# EAGLE design DAQ1 (EAGLE 7.5.0)

## Sheet 1 of 2
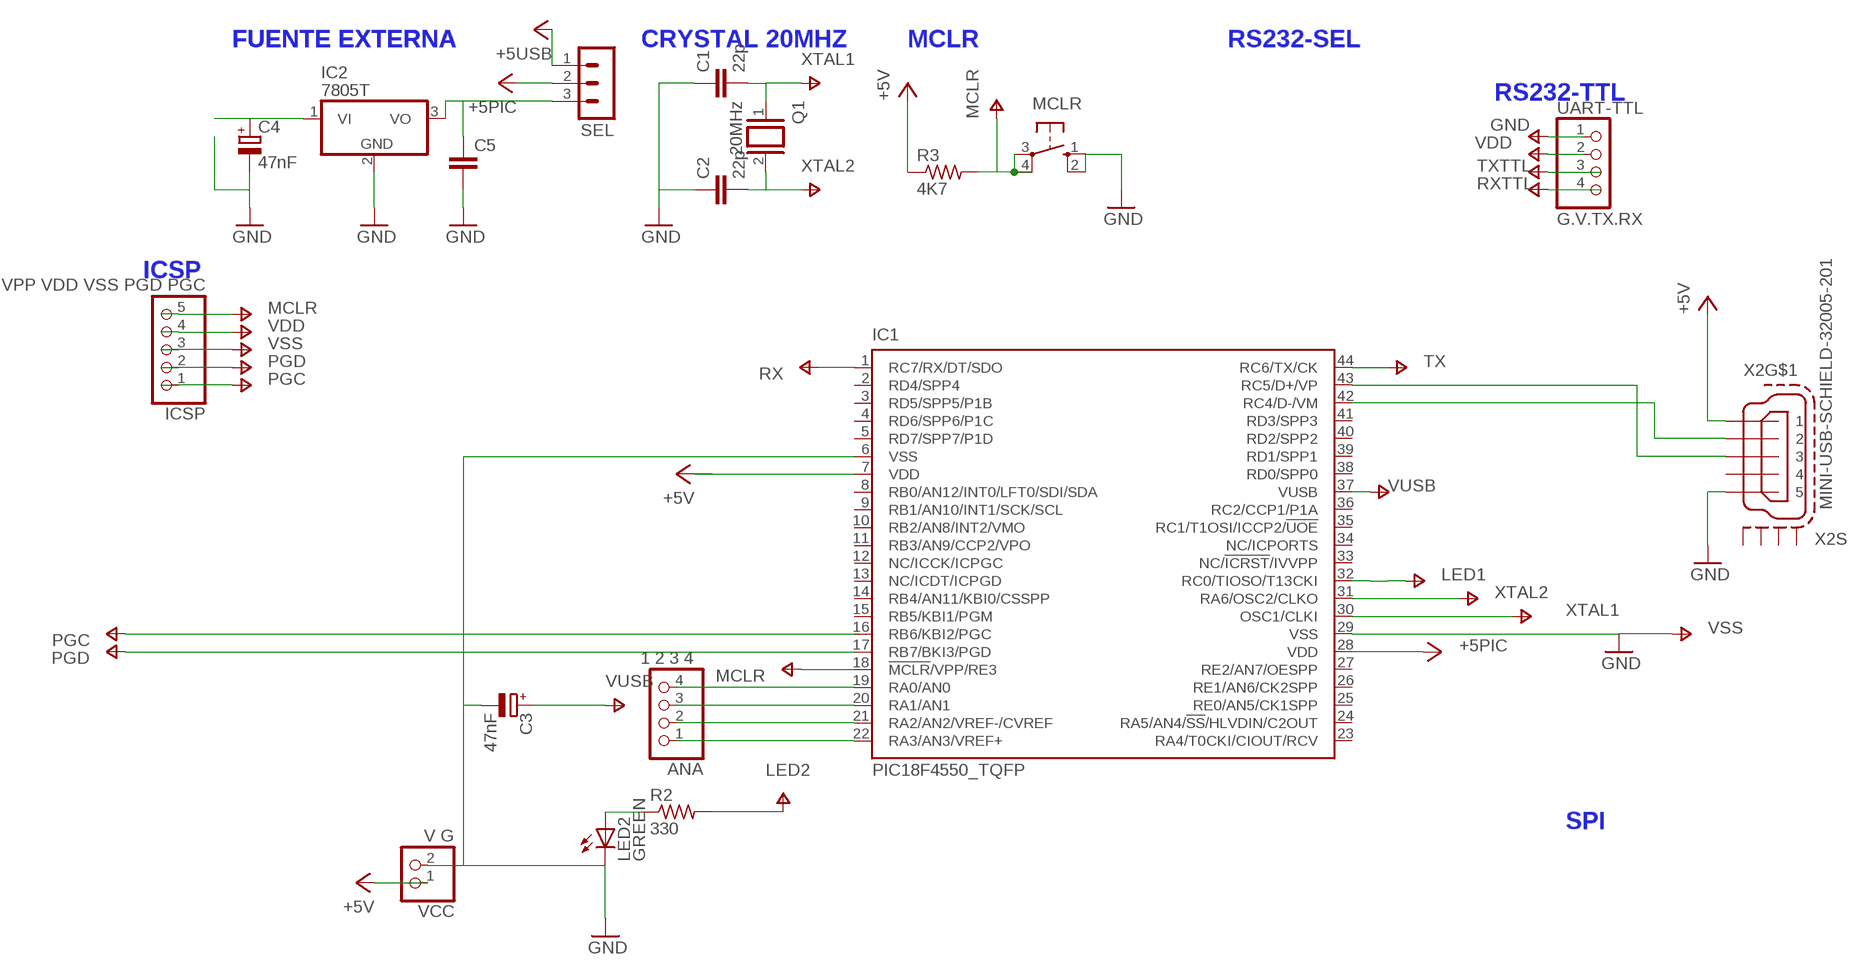
[diagram p0: schematic, sheet 1]

### Parts
ANA  1 2 3 4  PINHD-1X4  [1X04]
C1  22p  C-EU025-024X044  [C025-024X044]
C2  22p  C-EU025-024X044  [C025-024X044]
C3  47nF  CPOL-EUE2,5-6E  [E2,5-6E]
C4  47nF  CPOL-EUE2,5-6E  [E2,5-6E]
C5  C-EU050-035X075  [C050-035X075]
IC1  PIC18F4550_TQFP  [TQFP44]
IC2  7805T  [TO220H]
ICSP  VPP VDD VSS PGD PGC  PINHD-1X5  [1X05]
LED2  GREEN  TLLG4400  [LED3MM]
MCLR  10-XX  [B3F-10XX]
Q1  20MHz  XTAL/S  [QS]
R2  330  R-US_0207/10  [0207/10]
R3  4K7  R-US_0207/10  [0207/10]
SEL  MA03-1  [MA03-1]
UART-TTL  G.V.TX.RX  PINHD-1X4  [1X04]
VCC  V G  PINHD-1X2  [1X02]
X2  MINI-USB-SCHIELD-32005-201  [32005-201]

### Nets
+5PIC: IC1.7(VDD) IC1.28(VDD) ICSP.4 R3.1 SEL.2 UART-TTL.2 VCC.1 ; supply symbol labelled +5V, VDD
+5USB: SEL.1 X2.1 ; supply symbol labelled +5V
AN0: ANA.4 IC1.19(RA0/AN0) ; also sheet 2
GND: C1.1 C2.1 C3.- C4.- C5.2 IC1.6(VSS) IC1.29(VSS) IC2.2(GND) ICSP.3 LED2.K(C) MCLR.1(S) MCLR.2(S1) UART-TTL.1 VCC.2 X2.5 ; supply symbol labelled VSS ; also sheet 2
LED1: IC1.32(RC0/TIOSO/T13CKI) R2.2 ; supply symbol labelled LED2
MCLR: IC1.18(!MCLR!/VPP/RE3) ICSP.5 MCLR.3(P) MCLR.4(P1) R3.2
N$1: IC1.42(RC4/D-/VM) X2.2
N$5: LED2.A R2.1
N$15: IC1.43(RC5/D+/VP) X2.3
N$24: ANA.3 IC1.20(RA1/AN1)
N$25: ANA.2 IC1.21(RA2/AN2/VREF-/CVREF)
N$26: ANA.1 IC1.22(RA3/AN3/VREF+)
N$132: C5.1 IC2.3(VO) SEL.3
PGC: IC1.16(RB6/KBI2/PGC) ICSP.1
PGD: IC1.17(RB7/BKI3/PGD) ICSP.2
RX: IC1.1(RC7/RX/DT/SDO) UART-TTL.4 ; supply symbol labelled RXTTL
TX: IC1.44(RC6/TX/CK) UART-TTL.3 ; supply symbol labelled TXTTL
VDD: C4.+ IC2.1(VI) ; also sheet 2
VUSB: C3.+ IC1.37(VUSB)
XTAL1: C1.2 IC1.30(OSC1/CLKI) Q1.1
XTAL2: C2.2 IC1.31(RA6/OSC2/CLKO) Q1.2
Unconnected: IC1.2(RD4/SPP4) IC1.3(RD5/SPP5/P1B) IC1.4(RD6/SPP6/P1C) IC1.5(RD7/SPP7/P1D) IC1.8(RB0/AN12/INT0/LFT0/SDI/SDA) IC1.9(RB1/AN10/INT1/SCK/SCL) IC1.10(RB2/AN8/INT2/VMO) IC1.11(RB3/AN9/CCP2/VPO) IC1.12(NC/ICCK/ICPGC) IC1.13(NC/ICDT/ICPGD) IC1.14(RB4/AN11/KBI0/CSSPP) IC1.15(RB5/KBI1/PGM) IC1.23(RA4/T0CKI/CIOUT/RCV) IC1.24(RA5/AN4/!SS!/HLVDIN/C2OUT) IC1.25(RE0/AN5/CK1SPP) IC1.26(RE1/AN6/CK2SPP) IC1.27(RE2/AN7/OESPP) IC1.33(NC/!ICRST!/IVVPP) IC1.34(NC/ICPORTS) IC1.35(RC1/T1OSI/ICCP2/!UOE) IC1.36(RC2/CCP1/P1A) IC1.38(RD0/SPP0) IC1.39(RD1/SPP1) IC1.40(RD2/SPP2) IC1.41(RD3/SPP3) X2.4 X2.M1(S:S1) X2.M2(S:S2) X2.M3(S:S3) X2.M4(S:S4)

### Notes on the sheet
- FUENTE EXTERNA | FUENTE EXTERNA | CRYSTAL 20MHZ | MCLR | RS232-SEL
- RS232-TTL
- ICSP
- SPI

## Sheet 2 of 2
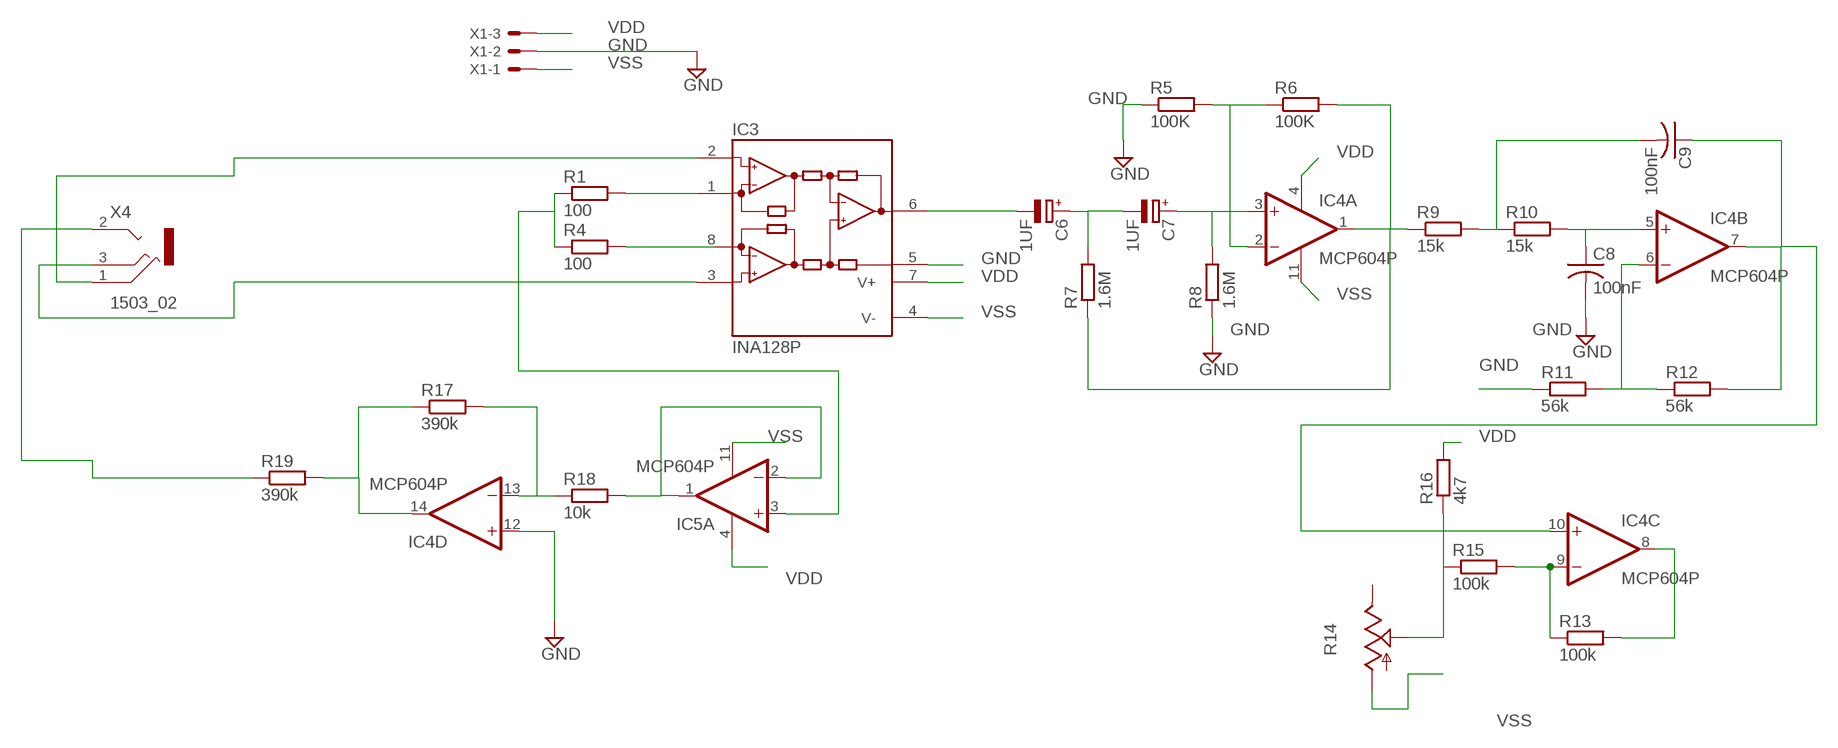
[diagram p1: schematic, sheet 2]

### Parts
C6  1UF  CPOL-EUE5-6  [E5-6]
C7  1UF  CPOL-EUE5-6  [E5-6]
C8  100nF  C-US050-030X075  [C050-030X075]
C9  100nF  C-US050-030X075  [C050-030X075]
IC3  INA128P  [DIL08]
IC4  MCP604P  [DIL14]
IC5  MCP604P  [DIL14]
R1  100  R-EU_0207/10  [0207/10]
R4  100  R-EU_0207/10  [0207/10]
R5  100K  R-EU_0207/10  [0207/10]
R6  100K  R-EU_0207/10  [0207/10]
R7  1.6M  R-EU_0207/10  [0207/10]
R8  1.6M  R-EU_0207/10  [0207/10]
R9  15k  R-EU_0207/10  [0207/10]
R10  15k  R-EU_0207/10  [0207/10]
R11  56k  R-EU_0207/10  [0207/10]
R12  56k  R-EU_0207/10  [0207/10]
R13  100k  R-EU_0207/10  [0207/10]
R14  TRIM_US-CA6V  [CA6V]
R15  100k  R-EU_0207/10  [0207/10]
R16  4k7  R-EU_0207/10  [0207/10]
R17  390k  R-EU_0207/10  [0207/10]
R18  10k  R-EU_0207/10  [0207/10]
R19  390k  R-EU_0207/10  [0207/10]
X1  KK-156-3  [KK-156-3]
X4  1503_02  [1503_02]

### Nets
AN0: IC4.8(C:OUT) R13.2 ; also sheet 1
GND: C8.2 IC3.5(REF) IC4.12(D:+IN) R5.1 R8.1 R11.1 X1.2 ; also sheet 1
N$2: IC5.3(A:+IN) R1.1 R4.1
N$3: IC4.1(A:OUT) R6.2 R7.1 R9.1
N$4: IC3.8(RG) R4.2
N$6: IC4.9(C:-IN) R13.1 R15.2
N$7: IC5.1(A:OUT) IC5.2(A:-IN) R18.2
N$8: IC4.13(D:-IN) R17.2 R18.1
N$9: IC4.14(D:OUT) R17.1 R19.2
N$10: R19.1 X4.2
N$11: R14.S R15.1 R16.1
N$12: C6.- IC3.6(OUT)
N$13: C6.+ C7.- R7.2
N$14: C7.+ IC4.3(A:+IN) R8.2
N$16: C9.2 R9.2 R10.1
N$17: IC4.2(A:-IN) R5.2 R6.1
N$18: C8.1 IC4.5(B:+IN) R10.2
N$19: IC4.6(B:-IN) R11.2 R12.1
N$21: C9.1 IC4.7(B:OUT) IC4.10(C:+IN) R12.2
N$28: IC3.2(-IN) X4.1
N$29: IC3.3(+IN) X4.3
N$31: IC3.1(RG) R1.2
VDD: IC3.7(V+) IC4.4(P:V+) IC5.4(P:V+) R16.2 X1.3 ; also sheet 1
VSS: IC3.4(V-) IC4.11(P:V-) IC5.11(P:V-) R14.A X1.1
Unconnected: IC5.5(B:+IN) IC5.6(B:-IN) IC5.7(B:OUT) IC5.8(C:OUT) IC5.9(C:-IN) IC5.10(C:+IN) IC5.12(D:+IN) IC5.13(D:-IN) IC5.14(D:OUT) R14.E X4.2@2

## Library data of the parts
ANA UART-TTL = pinhead:PINHD-1X4: PIN HEADER
C1 C2 C5 = rcl:C-EU: CAPACITOR, European symbol
C3 C4 C6 C7 = resistor:CPOL-EU: POLARIZED CAPACITOR, European symbol
C8 C9 = resistor:C-US: CAPACITOR, American symbol
IC1 = microchip:PIC18F4*_TQFP: USB Microcontrollers with nanoWatt Technology High-Performance, Enhanced Flash, 28/40/44-Pin, Source: http://ww1.microchip.com/downloads/en/devicedoc/39632c.pdf; MF: MICROCHIP; MPN: PIC18F4550-I/PT; OC_FARNELL: 9321365; OC_NEWARK: 08J9633
IC2 = linear:78*: Positive VOLTAGE REGULATOR Source: http://cache.national.com/ds/LM/LM78L05.pdf http://www.fairchildsemi.com/ds/LM/LM7805.pdf
IC3 = burr-brown:INA128: Instrumentation Amplifiers Precision, Low Power; MF: TEXAS INSTRUMENTS; MPN: INA128P; OC_FARNELL: 1212410; OC_NEWARK: 74C9783
IC4 IC5 = linear:MCP604: Quad Op Amp 2.7V to 6.0V Single Supply CMOS Source: http://ww1.microchip.com/downloads/en/DeviceDoc/21314g.pdf
ICSP = pinhead:PINHD-1X5: PIN HEADER
LED2 = led:TLLG4400: Low Current (2mA) LED 3 mm Tinted Diffused Package color GREEN Source: Data sheet <http://www.farnell.com/datasheets/391098.pdf>; MF: VISHAY SEMICONDUCTOR; OC_FARNELL: 1612435
MCLR = switch-omron:10-XX: OMRON SWITCH; MPN: B3F-1000; OC_FARNELL: 176432; OC_NEWARK: 36M3542
Q1 = special:XTAL/S: CRYSTAL
R1 R4-R13 R15-R19 = resistor:R-EU_: RESISTOR, European symbol
R2 R3 = resistor:R-US_: RESISTOR, American symbol
R14 = pot:TRIM_US-: POTENTIOMETER
SEL = con-lstb:MA03-1: PIN HEADER; OC_FARNELL: unknown; OC_NEWARK: unknown
VCC = pinhead:PINHD-1X2: PIN HEADER
X1 = con-molex:KK-156-3: KK 156 HEADER Source: http://www.molex.com/pdm_docs/sd/026604100_sd.pdf; OC_FARNELL: unknown; OC_NEWARK: unknown
X2 = con-cypressindustries:MINI-USB-SCHIELD-: MINI USB-B Conector Source: www.cypressindustries.com; OC_FARNELL: unknown; OC_NEWARK: unknown
X4 = con-lumberg:1503_02: Jack connectors according to JISC 6560, 3.5 mm Klinkeneinbaukupplung nach JISC 6560, 3,5 mm, 3-polig/stereo, abgewinkelte Ausführung, Surface-Mount-Technik (SMT) Source: http://www.lumberg.com/Produkte/PDFs/1503_02.pdf; OC_FARNELL: 1216979; OC_NEWARK: unknown

## Board
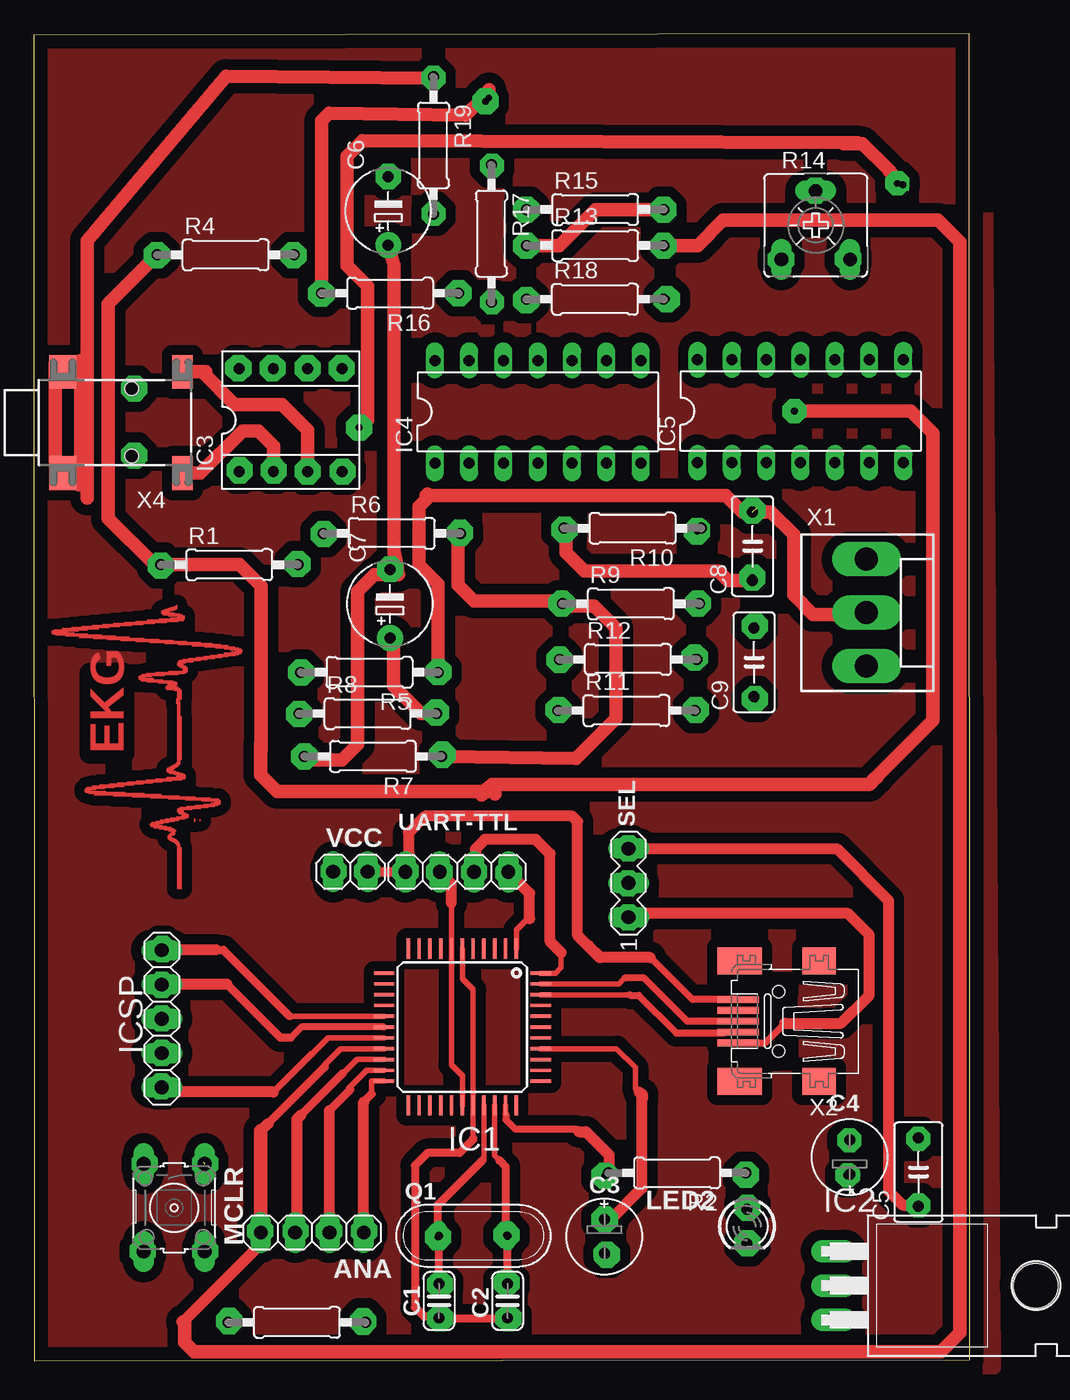
[diagram p2: board, top side]
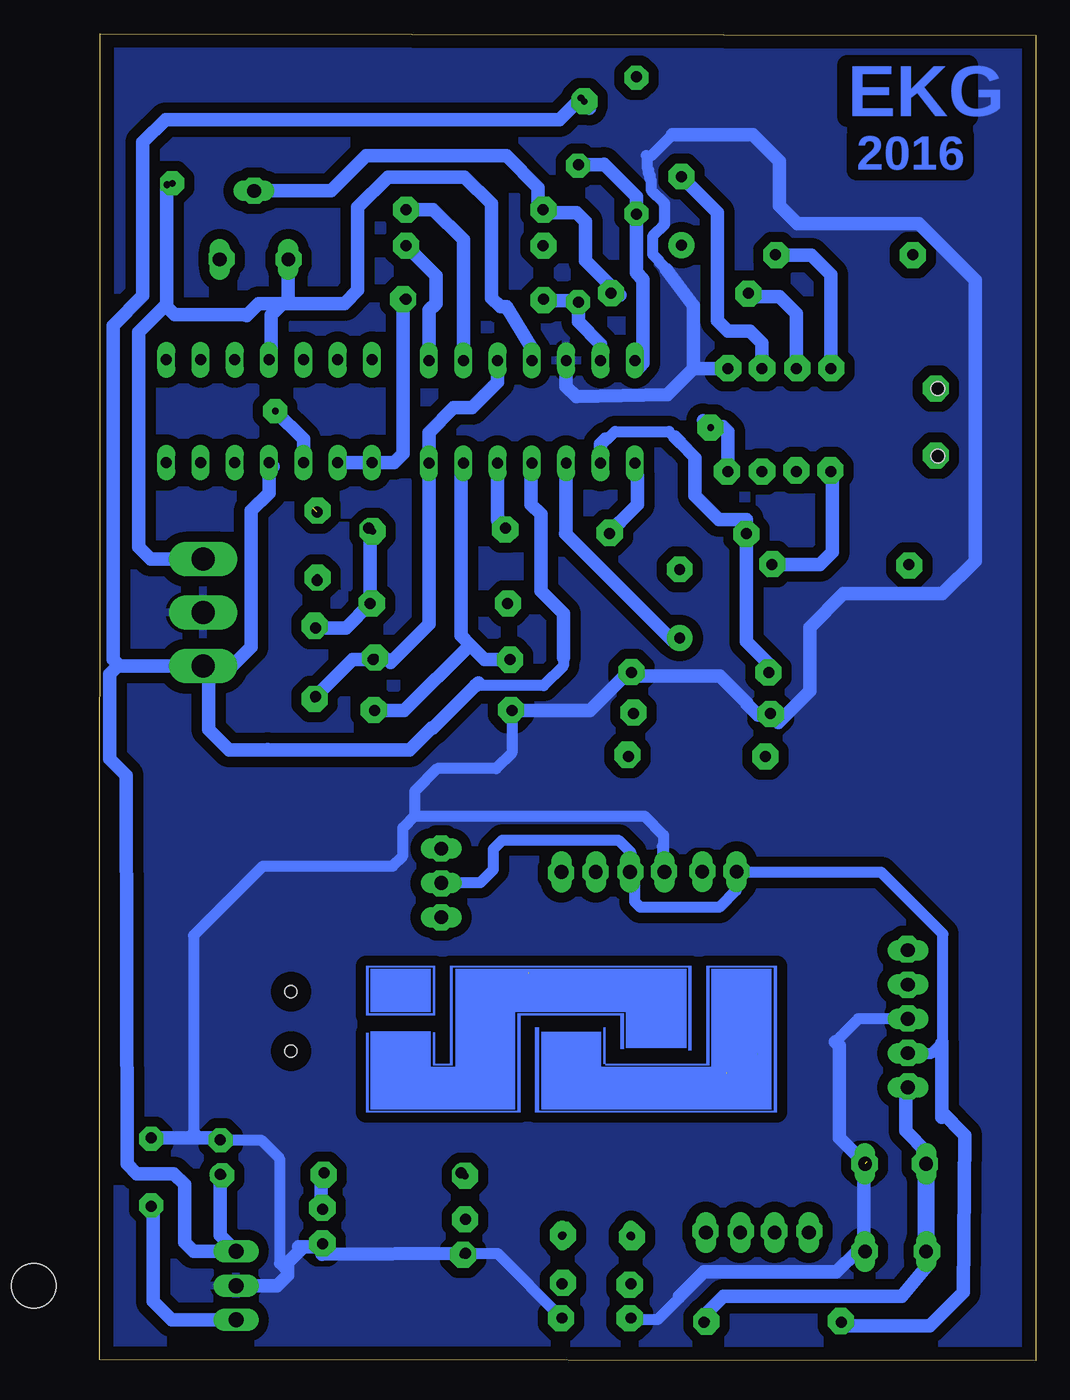
[diagram p3: board, bottom side, seen from below]

Size 69.3 x 98.24 mm. Coordinates in mm from the lower left corner, seen from the top.
Outline: 0.03,0 69.3,0.1 69.27,98.24 0,98.14 0.03,0
Copper layers (1*16): Top 0.035mm / dielectric 1.5mm / Bottom 0.035mm
Design rules "default *": minimum track width 10mil, minimum drill 24mil, track to track 30mil, track to pad 30mil, pad to pad 30mil, via to via 30mil, smd to smd 30mil, copper to edge 40mil, drill to drill 8mil, minimum pad ring 10mil, minimum via ring 8mil, stop-mask expansion 4mil, vias tented up to drill 0mil, thermal gap 10mil

### Footprints (pad centres in the part's own frame; a part is rotated, then mirrored left to right if it is on the bottom)
1X04 = drill 1.016 long: 1 -3.81,0; 2 -1.27,0; 3 1.27,0; 4 3.81,0
C025-024X044 = drill 0.813 octagon: 1 -1.27,0; 2 1.27,0
E2,5-6E = drill 0.813 pad 1.575: + -1.27,0 | drill 0.813 pad 1.575 octagon: - 1.27,0
C050-035X075 = drill 0.813 octagon: 1 -2.54,0; 2 2.54,0
E5-6 = drill 0.813 pad 1.905: + -2.54,0 | drill 0.813 pad 1.905 octagon: - 2.54,0
C050-030X075 = drill 0.813 octagon: 1 -2.54,0; 2 2.54,0
TQFP44 = smd 1.5 x 0.246: 1 -5.8,4; 2 -5.8,3.2; 3 -5.8,2.4; 4 -5.8,1.6; 5 -5.8,0.8; 6 -5.8,0; 7 -5.8,-0.8; 8 -5.8,-1.6; 9 -5.8,-2.4; 10 -5.8,-3.2; 11 -5.8,-4; 23 5.8,-4; 24 5.8,-3.2; 25 5.8,-2.4; 26 5.8,-1.6; 27 5.8,-0.8; 28 5.8,0; 29 5.8,0.8; 30 5.8,1.6; 31 5.8,2.4; 32 5.8,3.2; 33 5.8,4 | smd 0.246 x 1.5: 12 -4,-5.8; 13 -3.2,-5.8; 14 -2.4,-5.8; 15 -1.6,-5.8; 16 -0.8,-5.8; 17 0,-5.8; 18 0.8,-5.8; 19 1.6,-5.8; 20 2.4,-5.8; 21 3.2,-5.8; 22 4,-5.8; 34 4,5.8; 35 3.2,5.8; 36 2.4,5.8; 37 1.6,5.8; 38 0.8,5.8; 39 0,5.8; 40 -0.8,5.8; 41 -1.6,5.8; 42 -2.4,5.8; 43 -3.2,5.8; 44 -4,5.8
TO220H = drill 1.118 long: 1 -2.54,-10.16; 2 0,-10.16; 3 2.54,-10.16 | hole 3.302: 0,4.826
DIL08 = drill 0.813 pad 1.6 octagon: 1 -3.81,-3.81; 2 -1.27,-3.81; 3 1.27,-3.81; 4 3.81,-3.81; 5 3.81,3.81; 6 1.27,3.81; 7 -1.27,3.81; 8 -3.81,3.81
DIL14 = drill 0.813 long: 1 -7.62,-3.81; 2 -5.08,-3.81; 3 -2.54,-3.81; 4 0,-3.81; 5 2.54,-3.81; 6 5.08,-3.81; 7 7.62,-3.81; 8 7.62,3.81; 9 5.08,3.81; 10 2.54,3.81; 11 0,3.81; 12 -2.54,3.81; 13 -5.08,3.81; 14 -7.62,3.81
1X05 = drill 1.016 long: 1 -5.08,0; 2 -2.54,0; 3 0,0; 4 2.54,0; 5 5.08,0
LED3MM = drill 0.813 octagon: A -1.27,0; K 1.27,0
B3F-10XX = drill 1.016 long: 1 -3.251,2.261; 2 3.251,2.261; 3 -3.251,-2.261; 4 3.251,-2.261
QS = drill 0.61 long: 1 -2.54,0; 2 2.54,0
0207/10 = drill 0.813 octagon: 1 -5.08,0; 2 5.08,0
CA6V = drill 1.016 long: A -2.54,-2.54; E 2.54,-2.54; S 0,2.54
MA03-1 = drill 1.016 long: 1 -2.54,0; 2 0,0; 3 2.54,0
1X02 = drill 1.016 long: 1 -1.27,0; 2 1.27,0
KK-156-3 = drill 1.7 pad 2.184 long: 1 -3.96,0; 2 0,0; 3 3.96,0
32005-201 = smd 3.1 x 0.5: 1 3,1.6; 2 3,0.8; 3 3,0; 4 3,-0.8; 5 3,-1.6 | smd 2.5 x 2: M1 -3,-4.45; M2 -3,4.45 | smd 3.3 x 2: M3 2.9,4.45; M4 2.9,-4.45 | hole 0.9: 0,2.2; 0,-2.2
1503_02 = smd 2.5 x 1.5: 1 -3.75,-10.75; 3 3.75,-10.75 | smd 2.5 x 2: 2 -3.75,-1.9; 2@2 3.75,-1.9 | hole 1: -2.5,-7; 2.5,-7

### Placement (x,y rotation side)
ANA  20.62,9.51 180 top
C1  30,4.45 90 top
C2  35.08,4.45 90 top
C3  42.24,9.22 270 top
C4  60.4,15.09 90 top
C5  65.5,13.97 90 top
C6  26.25,85.14 90 top
C7  26.38,56.05 90 top
C8  53.22,60.31 90 top
C9  53.33,51.72 90 top
IC1  31.73,24.71 270 top
IC2  69.37,5.58 270 top
IC3  19.01,69.64 0 top
IC4  37.32,70.26 0 top
IC5  56.77,70.31 0 top
ICSP  9.48,25.32 270 top
LED2  52.81,9.96 270 top
MCLR  10.39,11.34 270 top
Q1  32.54,9.27 0 top
R1  14.48,58.94 0 top
R2  47.63,13.92 180 top
R3  19.48,2.86 0 top
R4  14.21,81.88 0 top
R5  24.85,50.97 180 top
R6  26.5,61.26 0 top
R7  25.11,44.75 180 top
R8  24.72,47.92 0 top
R9  44.21,56.05 0 top
R10  44.33,61.64 180 top
R11  43.87,48.14 0 top
R12  44,51.93 0 top
R13  41.56,82.57 0 top
R14  57.89,84.07 0 top
R15  41.56,85.24 0 top
R16  26.38,79.04 180 top
R17  33.88,83.46 270 top
R18  41.55,78.6 0 top
R19  29.59,89.98 270 top
SEL  44.03,35.38 90 top
UART-TTL  31.32,36.2 0 top
VCC  23.44,36.21 0 top
X1  61.66,55.39 270 top
X2  55.15,25.15 180 top
X4  0.26,69.47 90 top

### Tracks (layer width: path | path; a pad name or v marks a point on that pad's centre or on a via)
+5PIC  (via drill 0.6)
  Top 0.406: IC1.28 31.75,18.94 31.75,21.11 30.93,21.93 IC1.7 30.93,33.92
  Top 0.61: 22.15,36.19 VCC.1
  Top 0.711: v22.2,36.17 VCC.1
  Top 0.813: v44.06,35.41 SEL.2 | 30.93,33.92 30.93,35.32 UART-TTL.2
  Bottom 0.813: ICSP.4 7.72,22.78 6.99,23.52 6.89,23.62 6.89,31.6 11.46,36.17 v22.2,36.17 22.2,34.82 23.45,33.58 29.29,33.58 29.69,33.99 29.69,35.84 UART-TTL.2 30,36.25 30,37.64 30.91,38.56 39.5,38.56 40.16,37.9 40.16,36.37 41.12,35.41 v44.06,35.41
  Bottom 1.016: R3.1 14.45,2.59 7.85,2.59 5.36,5.08 5.26,16.71 6.99,18.44 | 6.99,18.03 6.99,18.44 | 6.99,18.44 6.99,23.52
+5USB
  Top 0.508: X2.1 54.16,23.55 55.6,24.99
  Top 0.813: 55.6,24.99 59.77,24.99 61.85,27.08 61.85,31.55 60.28,33.12 44.31,33.12 SEL.1 44.07,32.8
AN0
  Top 0.406: 21.54,21.77 21.54,21.92 22.71,23.09 25.9,23.09 IC1.19
  Top 0.61: 16.81,17.04 17.35,17.58 21.54,21.77
  Top 0.711: 16.8,9.53 ANA.4
  Top 0.813: 16.8,17.02 17.35,17.58 | 16.8,9.53 16.8,8.64 11.05,2.9
  Top 1.016: R13.2 49.17,82.57 51.03,84.43 66.98,84.43 68.56,82.85 68.56,2.08 67.13,0.66 11.86,0.66 11.15,1.37 11.15,2.79 11.05,2.9 | 16.8,9.53 16.8,17.02
  Bottom 1.016: R13.2 46.64,82.44 46.52,82.44 44.43,80.35 44.43,78.28 44.93,77.77 IC4.8
GND  (2 unrouted)
  Top 0.406: IC1.6 31.73,28.3 32.53,27.5 IC1.29 32.53,16.5
  Top 0.508: X2.5 48.77,26.75 45.65,29.87
  Top 0.61: 32.53,16.5 32.53,16.4 31.52,15.39 29.14,15.39 28.22,14.48 28.22,3.96 28.88,3.3 29.95,3.3 30.15,3.1 30.08,3.1 C1.1 C2.1
  Top 0.711: 29.92,3.25 C1.1 | VCC.2 27.5,36.21 UART-TTL.1
  Top 0.813: 12.73,14.67 MCLR.1 | 45.65,29.87 41.94,29.87 | 41.94,29.87 41.07,30.73 | 41.94,29.87 41.89,29.87 40.26,31.5 40.26,39.93 39.85,40.34 28.98,40.34 27.74,39.09 27.74,36.42 UART-TTL.1
  Top 1.016: 29.14,64.16 29.03,64.06 29.34,64.06 | 53.53,63.14 53.82,62.85 | X1.2 61.53,55.27 57.69,55.27 56.26,56.69 56.26,61.16 54.58,62.85 C8.2 52.45,62.85 51.23,64.06 29.34,64.06 | R5.1 29.93,57.52 28.53,58.93 28.53,63.25 29.34,64.06
  Bottom 0.61: 35.13,3.23 C2.1
  Bottom 0.813: 12.53,14.47 MCLR.1 | 12.16,14.37 12.53,14.73 | 12.53,8.21 MCLR.2 | C3.- 39.85,7.95 C2.1 | 26.39,4.78 26.39,4.67 28.02,3.05 29.87,3.05 C1.1 | ICSP.3 13.16,25.32 14.86,23.62 | C4.- 57.38,16.36 56.01,14.99 56.01,7.21 55.4,6.6 | 61.9,16.51 62.36,16.97 62.36,31.5 57.23,36.63 47.63,36.63 46.87,37.39 46.87,39.47 46,40.34 | 27.66,38.05 27.66,36.27 27.56,36.17 | UART-TTL.1 27.1,35.79 27.1,35.71 27.56,36.17 | 46,40.34 28.98,40.34 27.56,38.91 27.56,36.17 | R11.1 38.79,45 39.96,43.84 44.33,43.84 46,42.16 46,40.34 | 26.9,90.78 28.45,89.23 28.87,89.23 28.75,89.12 28.75,88.24 28.68,88.16 28.68,87.86 28.56,87.74 28.56,87.48 28.49,87.4 28.49,86.68 27.5,85.69 27.5,84.12 28.37,83.25 28.37,81.92 27.88,81.42 27.88,81.34 27.5,80.96 27.5,80.91 27.36,80.77
  Bottom 1.016: 29.75,2.92 C1.1 | 8.69,25.32 ICSP.3 | 12.93,14.73 12.88,14.73 12.73,14.58 12.73,14.88 12.93,14.88 14.56,16.51 14.56,23.32 14.86,23.62 | C3.- 52.83,7.9 LED2.K 53.06,8.43 54.23,8.43 | IC2.2 56.17,5.58 55.4,6.35 55.4,6.6 55.4,7.26 54.23,8.43 | 54.59,8.43 54.23,8.43 | C5.2 61.9,16.51 60.56,16.51 C4.- | 12.73,8.17 MCLR.2 | 12.73,8.17 13.2,8.17 14.76,6.6 24.56,6.6 26.39,4.78 | 12.73,8.17 12.73,14.52 MCLR.1 | IC3.5 25.36,73.45 | 25.36,73.45 25.36,78.11 27.36,80.77 | 26.9,90.78 20.97,90.78 19.01,88.82 19.01,85.53 17.67,84.2 8.68,84.2 4.51,80.02 4.51,59.23 6.94,56.79 14.25,56.79 16.74,54.31 16.74,49.58 19.08,47.24 19.08,47.36 19.52,47.8 | 19.52,47.8 R8.1 | IC4.12 34.77,72.14 34.01,71.37 27.28,71.53 25.36,73.45 | R11.1 33.01,48.14 30.46,50.7 | 30.46,50.7 23.4,50.7 21.41,48.72 21.41,48.62 20.6,47.8 19.52,47.8 | R5.1 30.18,50.97 30.46,50.7 | 27.46,36.25 UART-TTL.1
  pour Bottom: -0.53,98.41 -0.61,-0.7 70.88,-0.57 70.96,98.54
LED1
  Top 0.406: IC1.32 34.93,18.29 34.95,18.26
  Top 0.508: 34.95,18.26 34.95,17.86 35.64,17.17 40.16,17.17 40.36,16.97
  Top 0.813: R2.2 42.47,13.84 42.47,14.15 42.6,14.27 | 40.36,16.97 40.87,16.97 42.6,15.24 42.6,14.27 | 42.6,14.27 42.6,13.46 42.7,13.36
MCLR  (1 unrouted)
  Top 0.406: IC1.18 21.79,23.91 20.61,22.73
  Top 0.508: 20.61,22.73 20.57,22.73 17.76,19.91
  Top 0.813: 9.48,19.84 ICSP.5 9.81,19.91 17.76,19.91
  Bottom 1.016: 24.51,2.55 R3.2 24.53,2.59 24.53,3.39 23.14,4.78 9.93,4.78 8.13,6.99 MCLR.4 8.13,8.01 8.07,8.01 8.07,15.46 9.63,17.02 9.63,20.09 ICSP.5
  Bottom 1.27: MCLR.4 MCLR.3
N$1
  Top 0.406: IC1.42 44.11,27.11
  Top 0.508: 44.11,27.11 44.15,27.08 44.78,27.08 47.58,24.28 51.08,24.28 51.15,24.35 X2.2
N$2  (via drill 0.5 pad 1.78)
  Top 1.016: 62.41,43.18 62.36,43.18 | 62.36,43.18 61.85,42.67 33.91,42.67 33.68,42.44 | 33.68,42.44 33.15,41.91 | R4.1 5.52,78.28 5.52,62.36 8.94,58.94 R1.1 15.25,58.94 16.84,57.35 16.84,45.16 16.79,45.11 | v56.31,70.31 64.95,70.31 66.58,68.68 66.58,47.4 62.36,43.18 | 16.79,45.67 16.79,45.11 | 16.79,45.11 16.79,43.38 18.01,42.16 33.96,42.16 | 33.96,42.16 34.17,41.96 | 33.96,42.16 33.68,42.44
  Bottom 1.016: IC5.3 54.23,68.22 v56.31,70.31
N$3
  Top 1.016: 39,55.93 R9.1 | R6.2 31.4,60.47 31.4,57.42 32.59,56.24 38.94,56.24 R9.1 | R7.1 40.15,44.6 43.11,47.55 43.11,54.25 41.48,55.88 39.3,55.88 R9.1
  Bottom 1.016: R6.2 30.77,62.12 29.5,63.39 29.5,65.55 29.75,65.8 29.75,66.24 29.69,66.29 IC4.1
N$4
  Bottom 1.016: IC3.8 15.2,80.4 16.64,81.84 19.25,81.84 R4.2
N$5
  Bottom 1.016: LED2.A 52.91,11.33 52.91,13.72 R2.1
N$6
  Top 1.016: R15.2 41.59,85.24 38.9,82.55 36.51,82.55 R13.1
  Bottom 1.016: IC4.9 42.39,83 44.63,85.24 R15.2
N$7
  Bottom 1.016: IC5.2 IC5.1 47.53,66.5 46.87,67.16 46.87,78.36 R18.2
N$8
  Bottom 1.016: R18.1 36.35,78.48 33.98,78.48 R17.2 33.88,76.93 32.23,75.29 IC4.13
N$9
  Bottom 1.016: IC4.14 29.29,73.66 29.09,73.86 29.09,80.06 29.59,80.56 R19.2 29.59,86.2 31.98,88.6 32.04,88.54 R17.1
N$10
  Top 1.016: 2.07,65.63 X4.2 2.16,66.08 | 3.96,63.88 3.96,74.04 | 3.96,74.04 3.49,74.04 3.49,64.9 3.57,64.83 3.41,64.83 2.16,66.08 | 2.16,66.08 1.6,66.64 1.6,73.88 3.25,73.88 | 3.96,74.04 3.96,82.93 14.25,95.1 29.47,94.95 R19.1
N$11
  Bottom 1.016: R16.1 30.81,78.89 33.35,81.43 33.35,84.33 34.01,84.99 36.24,84.99 R15.1 36.86,85.61 36.86,86.87 39.19,89.2 49.61,89.2 52.2,86.61 R14.S
N$12
  Bottom 1.016: IC3.6 20.28,75.36 21.17,76.25 22.82,76.25 23.58,77.01 23.58,85.01 C6.-
N$13
  Top 1.016: 27.01,58.21 26.76,58.21 | 26.76,58.21 C7.- 26.95,58.59 26.66,59.88 26.66,81.11 C6.+ | 26.76,58.21 25.23,58.21 23.96,56.94 23.96,45.64 22.82,44.5 20.28,44.5 R7.2
N$14
  Top 1.016: C7.+ 26.63,53.26 26.63,49.96 28.66,47.92 R8.2
  Bottom 1.016: C7.+ 26.96,53.36 34.83,61.23 34.77,61.29 IC4.3
N$15
  Top 0.406: IC1.43 43.31,27.91 43.74,28.35
  Top 0.508: X2.3 48.39,25.15 45.19,28.35 43.74,28.35
N$16
  Bottom 1.016: 49.51,55.83 R9.2 | R9.2 49.29,61.51 R10.1 | C9.2 51.08,54.26 R9.2
N$17
  Bottom 0.813: 31.88,68.22 31.74,68.22 31.16,68.81 27.16,68.81 26.73,68.38
  Bottom 0.914: 25.23,66.85 25.23,66.88 26.33,67.98 | 26.33,67.98 | 26.33,67.98 26.41,68.05
  Bottom 1.016: R5.2 19.77,51.61 21.42,53.26 R6.1 21.42,62.28 23.45,62.28 25.23,64.05 25.23,66.85 | IC4.2 32.23,67.87 31.88,68.22 | 26.73,68.38 26.41,68.05
N$18
  Top 1.016: R10.2 39.4,61.5 39.4,59.84 40.77,58.47 50.68,58.47 51.38,57.77 C8.1
  Bottom 1.016: IC4.5 39.85,62.24 R10.2
N$19
  Bottom 1.016: R12.1 40.82,51.93 41.91,53.01 | IC4.6 42.39,65.86 42.58,65.68 42.58,53.69 41.91,53.01 | R11.2 46.78,48.14 41.91,53.01
N$20  (via drill 0.5 pad 1.78)
  other vias: 33.91,88.49
N$21
  Bottom 1.016: IC4.10 39.85,72.44 41.73,70.56 43.11,70.56 44.93,68.73 IC4.7 44.93,54.56 47.78,51.71 48,51.93 R12.2 50.58,51.93 C9.1 53.46,49.05
N$22  (via drill 0.5 pad 1.78)
  other vias: 33.91,78.38
N$23  (via drill 0.5 pad 1.78)
  other vias: 29.59,84.94
N$24  (1 unrouted)
  Top 0.406: IC1.20 23.95,22.31 22.92,21.28
  Top 0.61: 22.89,21.28 22.86,21.28 19.78,18.2 19.43,17.86 | 19.43,9.59 ANA.3
  Top 0.813: ANA.3 19.21,9.65 19.56,10.39 19.48,10.46 19.48,17.91 19.78,18.2
N$25
  Top 0.406: 23.44,20.1 23.44,20.12 23.3,19.98 23.3,20.18 24.63,21.5 25.91,21.5 IC1.21
  Top 0.61: 21.89,18.55 23.44,20.1
  Top 0.813: ANA.2 21.89,18.55
N$26
  Top 0.406: IC1.22 25.02,20.73 25.02,19.76
  Top 0.61: 24.43,19.17 25.02,19.76
  Top 0.813: ANA.1 24.43,19.17
N$27  (via drill 0.5 pad 1.78)
  other vias: 29.59,95
N$28
  Top 1.016: X4.1 12.34,65.72 15.46,68.84 16.65,68.84 17.75,67.74 IC3.2
N$29
  Top 1.016: X4.3 12.46,73.22 | 12.46,73.22 12.73,73.22 | IC3.3 20.28,68.91 18.38,70.81 14.87,70.81 12.46,73.22
N$30
  pour Bottom: -0.18,98.5 69.78,98.5 69.78,-0.71 -0.58,-0.71 -0.58,98.91 0.03,98.91
N$31
  Bottom 1.016: 14.99,65.93 15.22,65.7 15.33,65.7 IC3.1 15.06,65.7 15.06,59.89 16.01,58.94 R1.2
N$32  (via drill 0.5 pad 1.78)
  other vias: 63.93,87.17
N$40  (via drill 0.5 pad 1.93)
  other vias: 33.44,93.24
N$43  (via drill 0.5 pad 1.93)
  other vias: 27.54,36.25
N$44  (via drill 0.5 pad 1.93)
  other vias: 30.03,36.2
N$45
  pour Top: -0.64,98.72 -0.36,-0.8 71.11,-0.5 70.44,98.82
N$47  (via drill 0.5 pad 1.93)
  other vias: 19.8,50.97
N$48  (via drill 0.5 pad 1.93)
  other vias: 19.64,47.9
N$49  (via drill 0.5 pad 1.93)
  other vias: 20.03,44.75
N$50  (via drill 0.5 pad 1.93)
  other vias: 29.95,50.99
N$51  (via drill 0.5 pad 1.93)
  other vias: 44,35.36
N$52  (via drill 0.5 pad 1.93)
  other vias: 44.02,37.92
N$53  (via drill 0.5 pad 1.93)
  other vias: 44.02,32.84
N$54  (via drill 0.5 pad 1.93)
  other vias: 9.53,30.48
N$55  (via drill 0.5 pad 1.93)
  other vias: 9.48,27.84
N$56  (via drill 0.5 pad 1.93)
  other vias: 9.48,25.35
N$57  (via drill 0.5 pad 1.93)
  other vias: 9.48,22.81
N$58  (via drill 0.5 pad 1.93)
  other vias: 9.43,20.32
N$59  (via drill 0.5 pad 1.93)
  other vias: 29.8,48
N$60  (via drill 0.5 pad 1.93)
  other vias: 30.25,44.88
N$61  (via drill 0.5 pad 1.93)
  other vias: 39.09,56.08
N$62  (via drill 0.5 pad 1.93)
  other vias: 35.17,36.13
N$63  (via drill 0.5 pad 1.93)
  other vias: 32.6,36.2
N$64  (via drill 0.5 pad 1.93)
  other vias: 49.02,48.2
N$65  (via drill 0.5 pad 1.93)
  other vias: 38.93,51.91
N$66  (via drill 0.5 pad 1.93)
  other vias: 38.86,48.2
N$67  (via drill 0.5 pad 1.93)
  other vias: 39.29,61.54
N$68  (via drill 0.5 pad 1.93)
  other vias: 49.11,61.41
N$69  (via drill 0.5 pad 1.93)
  other vias: 49.17,56.08
N$72  (via drill 0.5 pad 1.93)
  other vias: 16.77,9.61
N$73  (via drill 0.5 pad 1.93)
  other vias: 19.38,9.61
N$74  (via drill 0.5 pad 1.93)
  other vias: 21.85,9.61
N$75  (via drill 0.5 pad 1.93)
  other vias: 24.47,9.61
N$76  (via drill 0.5 pad 1.93)
  other vias: 48.93,52.06
N$77  (via drill 0.5 pad 1.93)
  other vias: 53.4,48.99
N$81  (via drill 0.5 pad 1.93)
  other vias: 29.92,9.17
N$82  (via drill 0.5 pad 1.93)
  other vias: 35.01,9.32
N$83  (via drill 0.5 pad 1.93)
  other vias: 30.08,5.63
N$84  (via drill 0.5 pad 1.93)
  other vias: 30.08,3.16
N$85  (via drill 0.5 pad 1.93)
  other vias: 35.16,3.16
N$86  (via drill 0.5 pad 1.93)
  other vias: 35.01,5.78
N$87  (via drill 0.5 pad 1.93)
  other vias: 53.4,54.42
N$88  (via drill 0.5 pad 1.93)
  other vias: 53.2,62.94
N$89  (via drill 0.5 pad 1.93)
  other vias: 53.2,57.98
N$91  (via drill 0.5 pad 1.93)
  other vias: 42.27,10.47
N$92  (via drill 0.5 pad 1.93)
  other vias: 42.42,7.85
N$94  (via drill 0.5 pad 1.93)
  other vias: 52.73,13.79
N$95  (via drill 0.5 pad 1.93)
  other vias: 52.83,11.32
N$96  (via drill 0.5 pad 1.93)
  other vias: 52.83,8.71
N$98  (via drill 0.5 pad 1.93)
  other vias: 42.27,13.71
N$99  (via drill 0.5 pad 1.93)
  other vias: 8.06,8.11
N$100  (via drill 0.5 pad 1.93)
  other vias: 12.68,8.11
N$101  (via drill 0.5 pad 1.93)
  other vias: 12.68,14.58
N$102  (via drill 0.5 pad 1.93)
  other vias: 8.22,14.58
N$105  (via drill 0.5 pad 1.93)
  other vias: 24.39,2.92
N$106  (via drill 0.5 pad 1.93)
  other vias: 14.45,2.95
N$107  (via drill 0.5 pad 1.93)
  other vias: 15.15,73.49
N$108  (via drill 0.5 pad 1.93)
  other vias: 17.67,73.49
N$109  (via drill 0.5 pad 1.93)
  other vias: 20.27,73.49
N$110  (via drill 0.5 pad 1.93)
  other vias: 22.79,73.49
N$111  (via drill 0.5 pad 1.93)
  other vias: 15.23,65.93
N$112  (via drill 0.5 pad 1.93)
  other vias: 17.75,65.93
N$113  (via drill 0.5 pad 1.93)
  other vias: 20.27,65.85
N$114  (via drill 0.5 pad 1.93)
  other vias: 22.87,65.85
N$115  (via drill 0.5 pad 1.93)
  other vias: 9.12,81.87
N$116  (via drill 0.5 pad 1.93)
  other vias: 19.23,81.87
N$117  (via drill 0.5 pad 1.93)
  other vias: 9.39,58.89
N$118  (via drill 0.5 pad 1.93)
  other vias: 19.52,58.99
N$119  (via drill 0.5 pad 1.93)
  other vias: 21.45,61.2
N$120  (via drill 0.5 pad 1.93)
  other vias: 31.56,61.31
N$121  (via drill 0.5 pad 1.93)
  other vias: 21.29,79
N$122  (via drill 0.5 pad 1.93)
  other vias: 31.45,79.05
N$123  (via drill 0.5 pad 1.93)
  other vias: 36.46,85.22
N$124  (via drill 0.5 pad 1.93)
  other vias: 36.46,82.55
N$125  (via drill 0.5 pad 1.93)
  other vias: 36.46,78.53
N$126  (via drill 0.5 pad 1.93)
  other vias: 46.86,78.61
N$127  (via drill 0.5 pad 1.93)
  other vias: 46.62,82.55
N$128  (via drill 0.5 pad 1.93)
  other vias: 46.62,85.22
N$129  (via drill 0.5 pad 1.93)
  other vias: 22.19,36.26
N$130  (via drill 0.5 pad 1.93)
  other vias: 24.69,36.26
N$132
  Top 0.813: SEL.3 59.44,37.92 63.27,34.09 63.27,12.6 64.34,11.53 65.39,11.53 C5.1
  Top 1.016: 65.6,11.53 C5.1
  Bottom 1.016: IC2.3 63.97,3.04 65.36,4.42 65.36,11.29 C5.1
N$133  (via drill 0.6 pad 1.78)
  other vias: 60.25,13.75
N$134  (via drill 0.6 pad 1.78)
  other vias: 60.37,16.34
N$135  (via drill 0.6 pad 1.78)
  other vias: 65.5,11.52
N$136  (via drill 0.6 pad 1.78)
  other vias: 65.5,16.43
N$142  (via drill 0.5 pad 1.93)
  other vias: 55.33,81.54
N$143  (via drill 0.5 pad 1.93)
  other vias: 60.29,81.58
N$144  (via drill 0.5 pad 1.93)
  other vias: 57.87,86.63
N$145  (via drill 0.5 pad 1.93)
  other vias: 7.42,71.99
N$146  (via drill 0.5 pad 1.93)
  other vias: 7.42,67.03
PGC
  Top 0.406: IC1.16 18.95,25.51
  Top 0.61: 13.49,30.43 14.03,30.43 18.95,25.51
  Top 0.813: 13.49,30.43 9.5,30.43 ICSP.1
PGD
  Top 0.508: IC1.17 19.81,24.71 19.03,23.93
  Top 0.61: 19.03,23.93 18.26,23.93 14.3,27.89
  Top 0.813: 14.3,27.89 9.5,27.89 ICSP.2
RX
  Top 0.406: 36.71,32.74 36.58,32.74 35.73,31.89 IC1.1
  Top 0.813: 36.71,32.74 36.71,34.62 UART-TTL.4
TX  (1 unrouted)
  Top 0.406: 37.53,28.7 38.61,28.7 39.04,29.13 39.04,30.23
  Top 0.813: 39.04,30.23 38.23,31.04 38.23,37.54 37.16,38.61 33.4,38.61 32.69,37.9 32.69,36.3 UART-TTL.3
VDD  (via drill 0.5 pad 1.27)
  Top 1.016: R16.2 21.29,89.26 | 21.29,89.26 21.29,89.83 | 33.69,94.1 v33.69,93.49 33.27,93.49 31.98,92.2 21.87,92.35 21.31,91.8 21.31,89.27 21.29,89.26
  Bottom 0.813: 34.98,52.07 34.98,51.46 36.45,49.99 41.48,49.99 41.56,49.91
  Bottom 1.016: C4.+ 60.4,9.31 IC2.1 62.35,8.12 63.02,8.79 63.02,13.06 63.83,13.87 66.58,13.87 67.29,14.58 67.34,43.33 68.56,44.55 68.56,50.85 67.9,51.51 | IC3.7 17.74,77.52 19.01,78.79 21.04,78.79 R16.2 | 33.06,92.73 33.82,93.49 v33.69,93.49 35.29,91.9 64.44,91.9 66.12,90.22 66.12,78.84 68.3,76.66 68.3,51.92 67.9,51.51 | 34.98,52.07 34.98,55.32 36.65,57 36.65,62.69 37.37,63.41 37.37,65.6 37.31,65.66 IC4.4 | 41.28,50.19 41.56,49.91 44.63,46.84 44.73,46.84 46.36,45.21 56.82,45.21 | 56.82,45.21 56.87,45.26 | X1.3 61.66,50.76 | 56.82,45.21 59.72,45.21 61.24,46.74 61.24,51.02 X1.3 | X1.3 59.49,51.43 58.09,52.83 58.09,62.94 56.77,64.26 IC5.4 56.47,66.19 | X1.3 67.82,51.43 67.9,51.51
VSS  (via drill 0.5, 0.5 pad 1.93)
  Top 1.016: v24.09,69.09 24.72,69.64 24.72,79.55 23.2,81.07 23.2,89.2 24.34,90.34 59.92,90.19 | 59.92,90.19 60.97,90.19 | 59.92,90.19 59.99,90.12 61.34,90.12 63.32,88.14 63.32,88.09 v64.34,87.07
  Bottom 0.965: 24.64,69.64 v24.09,69.09
  Bottom 1.016: IC3.4 22.82,68.79 23.18,69.16 24.02,69.16 v24.09,69.09 | IC5.11 56.62,74.27 56.62,77.42 55.76,78.28 | IC4.11 37.31,74.93 39.19,78.03 39.65,78.03 40.31,78.69 40.31,85.65 42.29,87.63 47.98,87.63 50.22,85.39 50.22,79.25 51.18,78.28 55.2,78.28 | 55.2,78.28 55.76,78.28 | 55.76,78.28 57.53,78.28 58.35,77.47 | 58.35,77.47 58.42,77.39 | R14.A 55.35,78.44 55.2,78.28 | v64.34,87.07 64.34,78.03 | 64.34,78.03 63.78,77.47 58.35,77.47 | 64.34,78.03 64.54,78.03 66.42,76.15 66.42,60.25 65.53,59.35 X1.1
VUSB
  Top 0.406: IC1.37 43.14,23.11 44.54,21.72 44.54,20.18 44.82,19.9 44.96,19.76 45.05,19.76
  Top 0.813: 45.05,19.76 45.05,19.37 | C3.+ 42.72,10.49 45.04,12.8 45.04,19.69 44.82,19.9
XTAL1
  Top 0.406: IC1.30 33.33,17.68 | 33.33,17.68 33.33,17.3 | 33.25,14.88 33.25,14.99 33.35,15.09 33.35,17.65 33.33,17.68
  Top 0.61: C1.2 Q1.1 29.92,9.35 29.92,11.56 33.25,14.88
XTAL2
  Top 0.406: IC1.31 34.13,15.23 34.47,14.88
  Top 0.61: Q1.2 34.93,9.12 34.93,9.8 | 34.93,9.8 34.93,10.13 | C2.2 Q1.2 | Q1.2 35.08,9.65 34.93,9.8 | 34.47,14.88 34.47,14.83 34.93,14.38 34.93,9.42 Q1.2
(copper drawn outside any net)
  shapes: Bottom area x2551, Top area x785

### Text on the board
Top: EKG
Bottom: EKG | 2016
tNames: - | D:/IMAGENES/UDP MICROCHIP.bmp